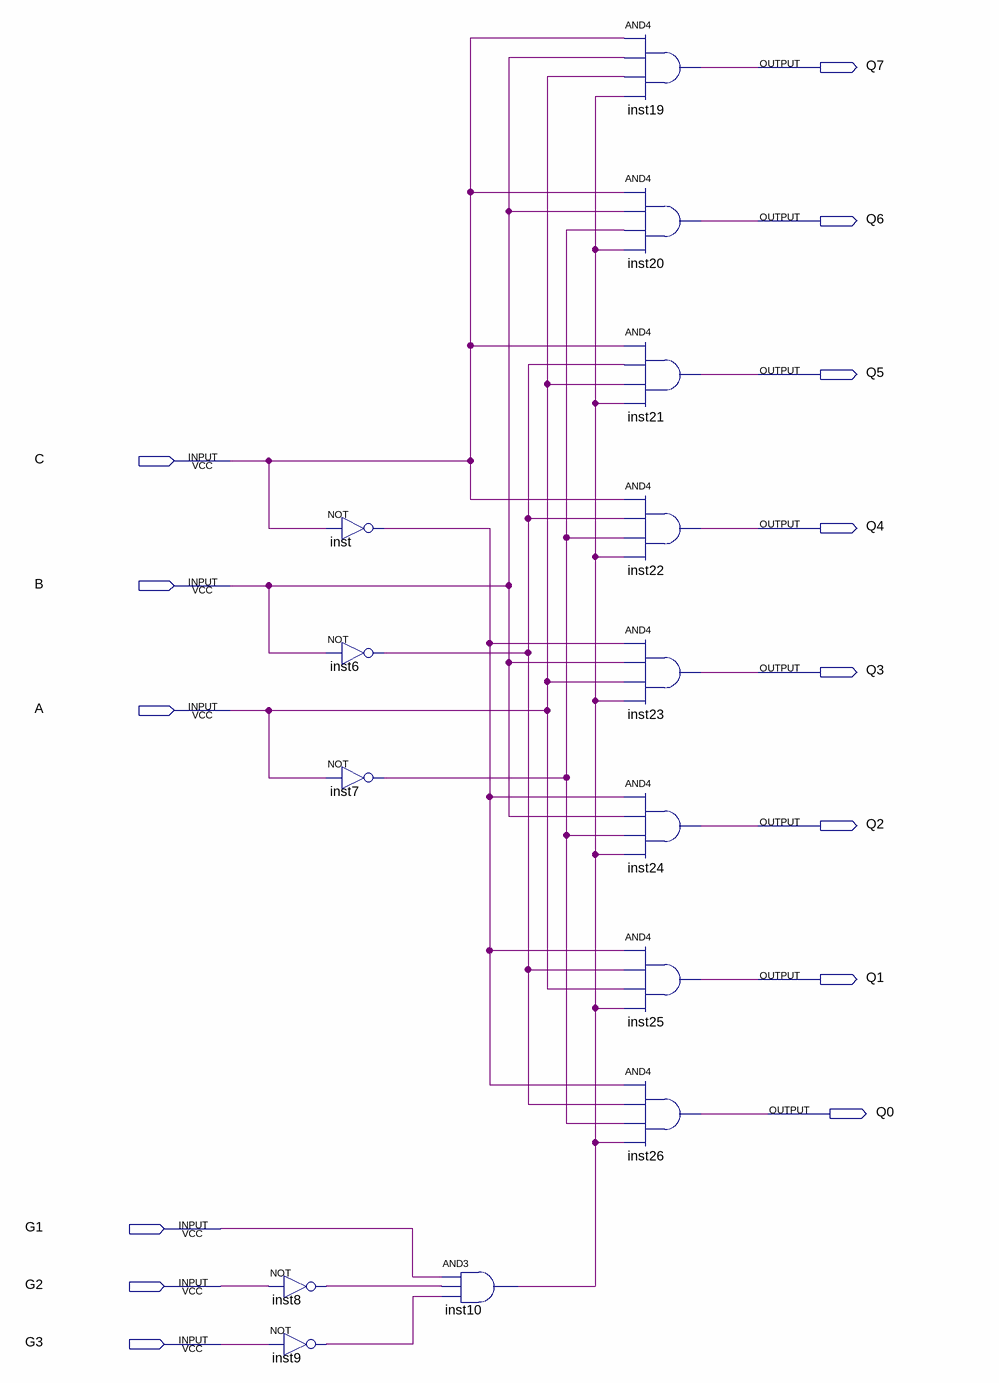
[diagram p0: schematic sheet]
// Quartus schematic decoder38.bdf as structural Verilog: 14 symbols, 14 pins
module decoder38 (
  input  C,
  input  B,
  input  A,
  input  G1,
  input  G2,
  input  G3,
  output Q7,
  output Q6,
  output Q5,
  output Q4,
  output Q3,
  output Q2,
  output Q1,
  output Q0
);

  wire inst6_out, inst7_out, inst8_out, inst9_out, inst10_out, inst_out;

  not inst8 (inst8_out, G2);
  not inst9 (inst9_out, G3);
  not inst (inst_out, C);
  not inst6 (inst6_out, B);
  not inst7 (inst7_out, A);
  and inst10 (inst10_out, G1, inst8_out, inst9_out);
  and inst19 (Q7, C, B, A, inst10_out);
  and inst20 (Q6, C, B, inst7_out, inst10_out);
  and inst21 (Q5, C, inst6_out, A, inst10_out);
  and inst22 (Q4, C, inst6_out, inst7_out, inst10_out);
  and inst23 (Q3, inst_out, B, A, inst10_out);
  and inst24 (Q2, inst_out, B, inst7_out, inst10_out);
  and inst25 (Q1, inst_out, inst6_out, A, inst10_out);
  and inst26 (Q0, inst_out, inst6_out, inst7_out, inst10_out);
endmodule
